# Altium schematic sheet TSAL-S01-V00-Control.SchDoc: TSAL Control
size A3; DrawnBy: Tom Benedetti; SheetNumber: 1; SheetTotal: 2; Version: 00; Project: TSAL; PageSetup: Record=PageOptions|CenterHorizontal=True|CenterVertical=True|PrintScale=0.97|XCorrection=1.00|YCorrection=1.00|PrintKind=0|BorderSize=5000000|LeftOffset=0|BottomOffset=0|Orientation=2|PaperLength=1000|PaperWidth=1000|Scale=100|PaperSource=7|PrintQuality=-4|MediaType=1|DitherType=10|PaperKind=A4|PrintScaleMode=1
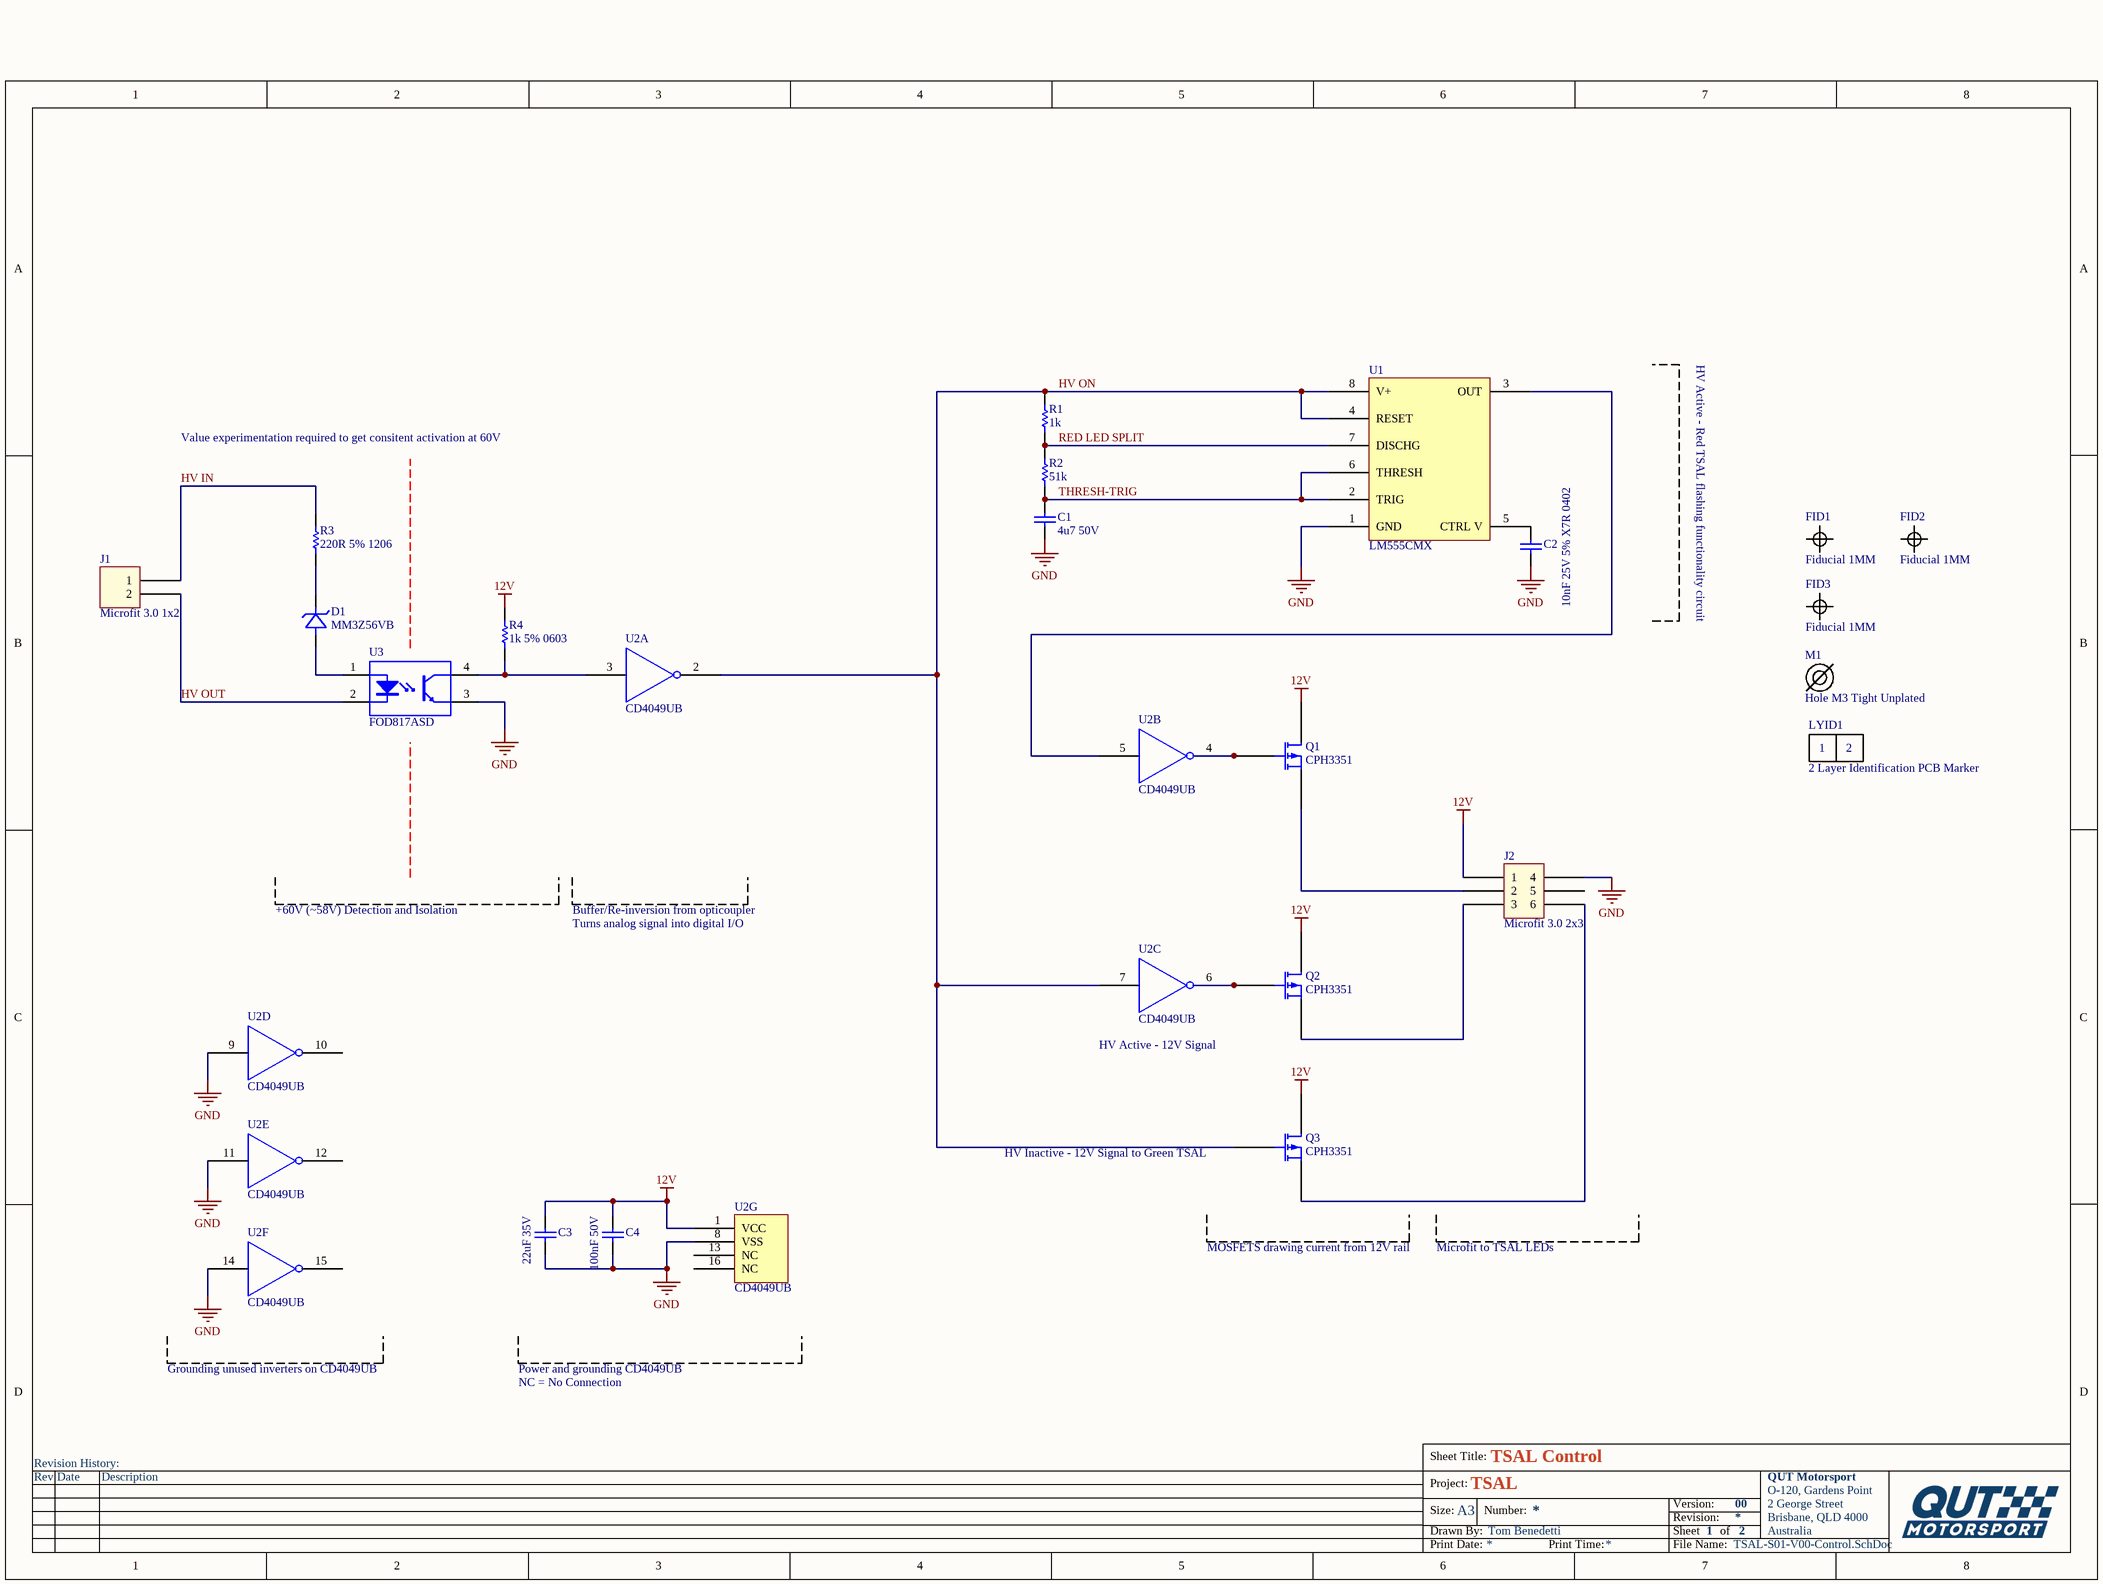
[diagram p0: TSAL-S01-V00-Control.SchDoc]

## Parts
C1  4u7 50V  [Cap_Ceramic_0603]
C2  10nF 25V 5% X7R 0402  [Cap_Ceramic_1206]
C3  22uF 35V  [Cap_Ceramic_1206]
C4  100nF 50V  [Cap_Ceramic_0603]
D1  MM3Z56VB  [SOD-323F]
FID1  Fiducial 1MM  [FIDUCIAL 1MM]
FID2  Fiducial 1MM  [FIDUCIAL 1MM]
FID3  Fiducial 1MM  [FIDUCIAL 1MM]
J1  Microfit 3.0 1x2  [Microfit_1X2_R_TH]
J2  Microfit 3.0 2x3  [Microfit_2X3_R_TH]
LYID1  2 Layer Identification PCB Marker  [LAYER IDENT 2]
M1  Hole M3 Tight Unplated  [M3.2 UNPLATED]
Q1  CPH3351  [SOT-23-3]
Q2  CPH3351  [SOT-23-3]
Q3  CPH3351  [SOT-23-3]
R1  1k  [Res_ThinFilm_0603]
R2  51k  [Res_ThinFilm_0603]
R3  220R 5% 1206  [Res_ThinFilm_1206]
R4  1k 5% 0603  [Res_ThinFilm_0603]
U1  LM555CMX  [MCP2561 SOIC]
U2  CD4049UB  [CD4049UB]  (parts A,B,C,D,E,F,G of 7)
U3  FOD817ASD  [FOD817ASD]

## Nets
12V: C3.2 C4.2 J2.1 Q1.D Q2.D Q3.D R4.2 U2.1(VCC)
GND: C1.1 C2.1 C3.1 C4.1 J2.4 U1.1(GND) U2.8(VSS) U2.9(D) U2.11(E) U2.14(F) U3.3(EMITTER)
HV IN: J1.1 R3.2
HV ON: Q3.G R1.2 U1.4(RESET) U1.8(V+) U2.2(G) U2.7(C)
HV OUT: J1.2 U3.2(CATHODE)
RED LED SPLIT: R1.1 R2.2 U1.7(DISCHG)
THRESH-TRIG: C1.2 R2.1 U1.2(TRIG) U1.6(THRESH)
NetC2_2: C2.2 U1.5(CTRL_V)
NetD1_1: D1.1(Anode) U3.1(ANODE)
NetD1_2: D1.2(Cathode) R3.1
NetJ2_2: J2.2 Q1.S
NetJ2_3: J2.3 Q2.S
NetJ2_6: J2.6 Q3.S
NetQ1_G: Q1.G U2.4(H)
NetQ2_G: Q2.G U2.6(I)
NetR4_1: R4.1 U2.3(A) U3.4(COLLECTOR)
NetU1_3: U1.3(OUT) U2.5(B)

Not connected (* = marked no-connect by the designer): J2 5; U2 10(J) 12(K) 13(NC) 15(L) 16(NC)

## Notes on the sheet
- HV Active - Red TSAL flashing functionality circuit
- Value experimentation required to get consitent activation at 60V
- +60V (~58V) Detection and Isolation
- Buffer/Re-inversion from opticoupler
- Turns analog signal into digital I/O
- HV Active - 12V Signal
- (near Q3) HV Inactive - 12V Signal to Green TSAL
- MOSFETS drawing current from 12V rail
- Microfit to TSAL LEDs
- Grounding unused inverters on CD4049UB
- Power and grounding CD4049UB
- NC = No Connection
- Revision History:
- Sheet Title:
- Rev
- Date
- Description
- Project:
- Size:
- Drawn By:
- A3
- Number:
- Revision:
- Sheet
- Version:
- of
- QUT Motorsport
- O-120, Gardens Point
- 2 George Street
- Brisbane, QLD 4000
- Australia
- Print Date:
- Print Time:
- File Name:
- (in symbol Layer Identification 2) 1; 2

## Library data of the parts
C1 = 4u7 50V 5% X7R 0603: Capacitor, Ceramic, SMD, 4u7, 50V, 5%, X7R, 0603
C2 = 10nF 25V 5% X7R 0402: 10000pF ±5% 25V Ceramic Capacitor X7R 0402 (1005 Metric) /; ComponentLink1Description: Digikey; ComponentLink1URL: https://www.digikey.com/product-detail/en/murata-electronics/GRM155R71E103JA01J/490-6340-1-ND/3845537; ComponentLink2Description: Datasheet; ComponentLink2URL: https://search.murata.co.jp/Ceramy/image/img/A01X/G101/ENG/GRM155R71E103JA01-01.pdf
C3 = 22uF 35V 20% X5R 1206: 22µF ±20% 35V Ceramic Capacitor X5R 1206 (3216 Metric); ComponentLink1Description: Digikey; ComponentLink1URL: https://www.digikey.com.au/product-detail/en/tdk-corporation/C3216X5R1V226M160AC/445-8045-1-ND/2792165; ComponentLink2Description: Datasheet; ComponentLink2URL: https://product.tdk.com/info/en/catalog/datasheets/mlcc_commercial_general_en.pdf
C4 = 100nF 50V 5% X7R 0603: Capacitor, Ceramic, SMD, 100nF, 50V, 5%, X7R, 0603
D1 = MM3Z56VB: Zener Diode 56V 200mW ±2% Surface Mount SOD-323F; Manufacturer: ON Semiconductor; MPN: MM3Z56VB; ComponentLink1Description: Digikey; ComponentLink1URL: https://www.digikey.com.au/product-detail/en/on-semiconductor/MM3Z56VB/MM3Z56VBCT-ND/1626897; ComponentLink2Description: Datasheet; ComponentLink2URL: https://www.onsemi.com/pub/Collateral/MM3Z9V1B-D.pdf
J1 = Microfit_1x2
J2 = Microfit_2x3
LYID1 = Layer Identification 2
M1 = Hole M3 Tight Unplated: M3.2 Hole, No Plating
Q1-Q3 = CPH3351: P-Channel 60V 1.8A (Ta) 1W (Ta) Surface Mount 3-CPH; ComponentLink1Description: Datasheet; ComponentLink1URL: https://www.onsemi.com/pub/Collateral/CPH3351-D.PDF; ComponentLink2Description: Digikey; ComponentLink2URL: https://www.digikey.com/products/en/discrete-semiconductor-products/transistors-fets-mosfets-single/278?k=&pkeyword=&sv=0&pv7=2&sf=0&FV=-1%7C488%2C-8%7C278&mpart=CPH3351-TL-W&quantity=&ColumnSort=0&page=1&stock=1&nstock=1&datasheet=1&photo=1&pageSize=25
R1 R4 = 1k 5% 0603: Resistor, SMD, 1k, 0.1W, 5%, 0603
R2 = 51k 5% 0603: 51 kOhms ±0.1% 0.063W, 1/16W Chip Resistor 0402 (1005 Metric) Automotive AEC-Q200 Thin Film; ComponentLink1Description: Digikey; ComponentLink1URL: https://www.digikey.com.au/product-detail/en/panasonic-electronic-components/ERA-2AEB513X/P51KDCCT-ND/1706224; ComponentLink2Description: Datasheet1; ComponentLink2URL: https://industrial.panasonic.com/cdbs/www-data/pdf/RDM0000/AOA0000C307.pdf; ComponentLink3Description: Datasheet2; ComponentLink3URL: https://media.digikey.com/pdf/Data%20Sheets/Panasonic%20Resistors%20Thermistors%20PDFs/ERA_Series_LE.pdf; ComponentLink4Description: Datasheet3; ComponentLink4URL: https://industrial.panasonic.com/cdbs/www-data/pdf/RDM0000/DMM0000COL9.pdf
R3 = 220R 5% 1206: 220 Ohms ±1% 0.25W, 1/4W Chip Resistor 1206 (3216 Metric) Moisture Resistant Thick Film; ComponentLink1Description: Digikey; ComponentLink1URL: https://www.digikey.com.au/product-detail/en/yageo/RC1206FR-07220RL/311-220FRCT-ND/731640; ComponentLink2Description: Datasheet; ComponentLink2URL: https://www.yageo.com/upload/media/product/productsearch/datasheet/rchip/PYu-RC_Group_51_RoHS_L_10.pdf
U1 = LM555CMX: 555 Type, Timer/Oscillator (Single) IC 100kHz 8-SOIC; ComponentLink1Description: Digikey; ComponentLink1URL: https://www.digikey.com.au/product-detail/en/texas-instruments/LM555CMX%2FNOPB/LM555CMX%2FNOPBCT-ND/1010545?utm_adgroup=Integrated%20Circuits&utm_source=google&utm_medium=cpc&utm_campaign=Dynamic%20Search_EN_Product&utm_term=&productid=&gclid=CjwKCAjwr7X4BRA4EiwAUXjbt-N3vibcCncJp7dB6lpBrLRT-QxYTJoHZmGPqFSswFIeP9Lhu7cYVBoCjmMQAvD_BwE; ComponentLink2Description: Datasheet; ComponentLink2URL: https://www.ti.com/general/docs/suppproductinfo.tsp?distId=10&gotoUrl=http%3A%2F%2Fwww.ti.com%2Flit%2Fgpn%2Flm555
U3 = FOD817ASD: Optoisolator 5kV Transistor 4SMD